# EAGLE design mLRS-tx-dual-base-v042-np (EAGLE 7.5.0)
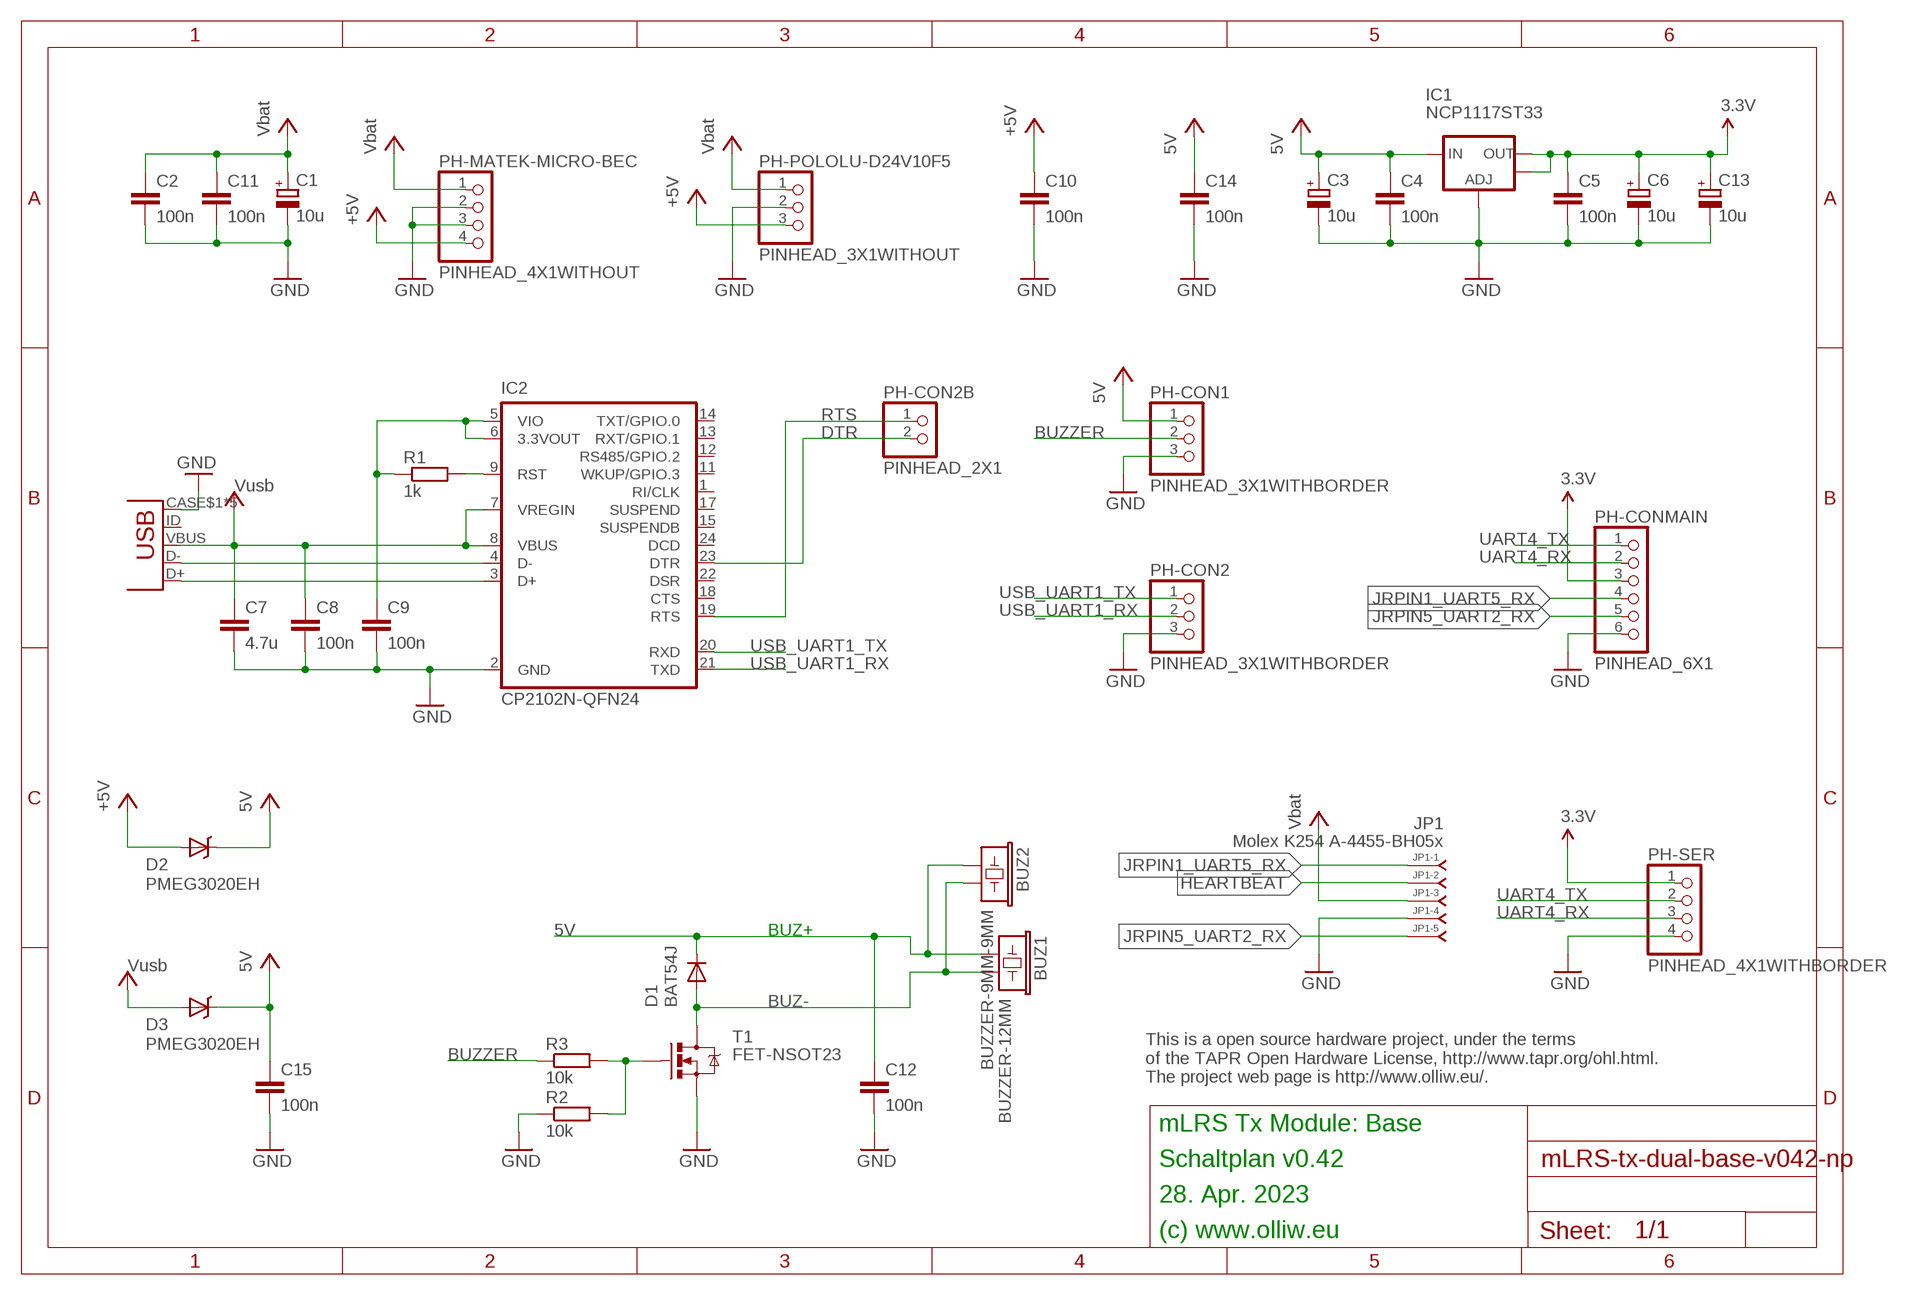
[diagram p0: schematic, sheet 1]

## Parts
BUZ1  BUZZER-12MM  [BUZZER-12MM]
BUZ2  BUZZER-9MM-9MM  [BUZZER-9MM]
C1  10u  CPOL-EUSMCA  [SMC_A]
C2  100n  C-EUC0603  [C0603]
C3  10u  CPOL-EUSMCA  [SMC_A]
C4  100n  C-EUC0603  [C0603]
C5  100n  C-EUC0603  [C0603]
C6  10u  CPOL-EUSMCA  [SMC_A]
C7  4.7u  C-EUC0603  [C0603]
C8  100n  C-EUC0402  [C0402]
C9  100n  C-EUC0402  [C0402]
C10  100n  C-EUC0603  [C0603]
C11  100n  C-EUC0603  [C0603]
C12  100n  C-EUC0603  [C0603]
C13  10u  CPOL-EUSMCA  [SMC_A]
C14  100n  C-EUC0603  [C0603]
C15  100n  C-EUC0603  [C0603]
D1  BAT54J  DIODE-SOD110-R  [SOD110-R]
D2  PMEG3020EH  DIODE-SCHOTTKYSOD123-W  [SOD123W-DIODE]
D3  PMEG3020EH  DIODE-SCHOTTKYSOD123-W  [SOD123W-DIODE]
IC1  NCP1117ST33  V_REG_LM1117SOT223  [SOT223]
IC2  CP2102N-QFN24  [QFN24-CP2102N]
JP1  Molex K254 A-4455-BH05x  4455-B05_S  [4455-B05]
PH-CON1  PINHEAD_3X1WITHBORDER  [PINHEAD_3X1]
PH-CON2  PINHEAD_3X1WITHBORDER  [PINHEAD_3X1]
PH-CON2B  PINHEAD_2X1  [PINHEAD_2X1]
PH-CONMAIN  PINHEAD_6X1  [PINHEAD_6X1]
PH-MATEK-MICRO-BEC  PINHEAD_4X1WITHOUT  [PINHEAD_4X1_WO]
PH-POLOLU-D24V10F5  PINHEAD_3X1WITHOUT  [PINHEAD_3X1_WO]
PH-SER  PINHEAD_4X1WITHBORDER  [PINHEAD_4X1]
R1  1k  R-EU_R0402  [R0402]
R2  10k  R-EU_R0402  [R0402]
R3  10k  R-EU_R0402  [R0402]
T1  FET-NSOT23  [SOT23]
USB1  USB-MICROB-UP-NONPLATED  [USB-MICROB-UP-NONPLATED]

## Nets
3.3V: C5.1 C6.+ C13.+ IC1.2(OUT) IC1.4(OUT) PH-CONMAIN.3 PH-SER.1
3.3V-CP2102: C9.1 IC2.5(VIO) IC2.6(3.3VOUT) R1.1
5V: BUZ1.+ BUZ2.+ C3.+ C4.1 C12.1 C14.1 C15.1 D1.C D2.C D3.C IC1.3(IN) PH-CON1.1
+5V: C10.1 D2.A PH-MATEK-MICRO-BEC.4 PH-POLOLU-D24V10F5.3
BUZ-: BUZ1.- BUZ2.- D1.A T1.3(D)
BUZZER: PH-CON1.2 R3.1
DTR: IC2.23(DTR) PH-CON2B.2
GND: C1.- C2.2 C3.- C4.2 C5.2 C6.- C7.2 C8.2 C9.2 C10.2 C11.2 C12.2 C13.- C14.2 C15.2 IC1.1(ADJ) IC2.2(GND) JP1.4 PH-CON1.3 PH-CON2.3 PH-CONMAIN.6 PH-MATEK-MICRO-BEC.2 PH-MATEK-MICRO-BEC.3 PH-POLOLU-D24V10F5.2 PH-SER.4 R2.1 T1.2(S) USB1.CASE$1(GND) USB1.CASE$2(GND) USB1.CASE$3(GND) USB1.CASE$4(GND) USB1.GND
HEARTBEAT: JP1.2
JRPIN1_UART5_RX: JP1.1 PH-CONMAIN.4
JRPIN5_UART2_RX: JP1.5 PH-CONMAIN.5
N$1: IC2.4(D-) USB1.D-
N$2: R2.2 R3.2 T1.1(G)
N$3: IC2.3(D+) USB1.D+
N$21: IC2.9(RST) R1.2
RTS: IC2.19(RTS) PH-CON2B.1
UART4_RX: PH-CONMAIN.2 PH-SER.3
UART4_TX: PH-CONMAIN.1 PH-SER.2
USB_UART1_RX: IC2.21(TXD) PH-CON2.2
USB_UART1_TX: IC2.20(RXD) PH-CON2.1
VBAT: C1.+ C2.1 C11.1 JP1.3 PH-MATEK-MICRO-BEC.1 PH-POLOLU-D24V10F5.1 ; supply symbol labelled Vbat
VUSB: C7.1 C8.1 D3.A IC2.7(VREGIN) IC2.8(VBUS) USB1.VBUS ; supply symbol labelled Vusb
Unconnected: IC2.1(RI/CLK) IC2.11(WKUP/GPIO.3) IC2.12(RS485/GPIO.2) IC2.13(RXT/GPIO.1) IC2.14(TXT/GPIO.0) IC2.15(SUSPENDB) IC2.17(SUSPEND) IC2.18(CTS) IC2.22(DSR) IC2.24(DCD) USB1.ID

## Notes on the sheet
- BUZ+
- This is a open source hardware project, under the terms
  of the TAPR Open Hardware License, http://www.tapr.org/ohl.html.
  The project web page is http://www.olliw.eu/.
- mLRS Tx Module: Base
- Schaltplan v0.42
- 28. Apr. 2023
- (c) www.olliw.eu

## Library data of the parts
BUZ1 BUZ2 = # stdlib:BUZZER
C1 C3 C6 C13 = rcl:CPOL-EU: POLARIZED CAPACITOR, European symbol
C2 C4 C5 C7-C12 C14 C15 = rcl:C-EU: CAPACITOR, European symbol
D1 = diode:DIODE-: DIODE
D2 D3 = # stdlib:DIODE-SCHOTTKY
IC1 = # SparkFun2:V_REG_LM1117: Voltage Regulator LM1117 Standard adjustable voltage regulator but in SMD form. Spark Fun Electronics SKU : COM-00595
IC2 = # stdlib:CP2102N-QFN24
JP1 = con-molex-kk:4455-B05_S: RECEPTACAL
PH-CON1 PH-CON2 PH-POLOLU-D24V10F5 = # stdlib:PINHEAD_3X1
PH-CON2B = # stdlib:PINHEAD_2X1
PH-CONMAIN = # stdlib:PINHEAD_6X1
PH-MATEK-MICRO-BEC PH-SER = # stdlib:PINHEAD_4X1
R1-R3 = rcl:R-EU_: RESISTOR, European symbol
T1 = # stdlib:FET-N
USB1 = # stdlib:USB-MICROB

## Board
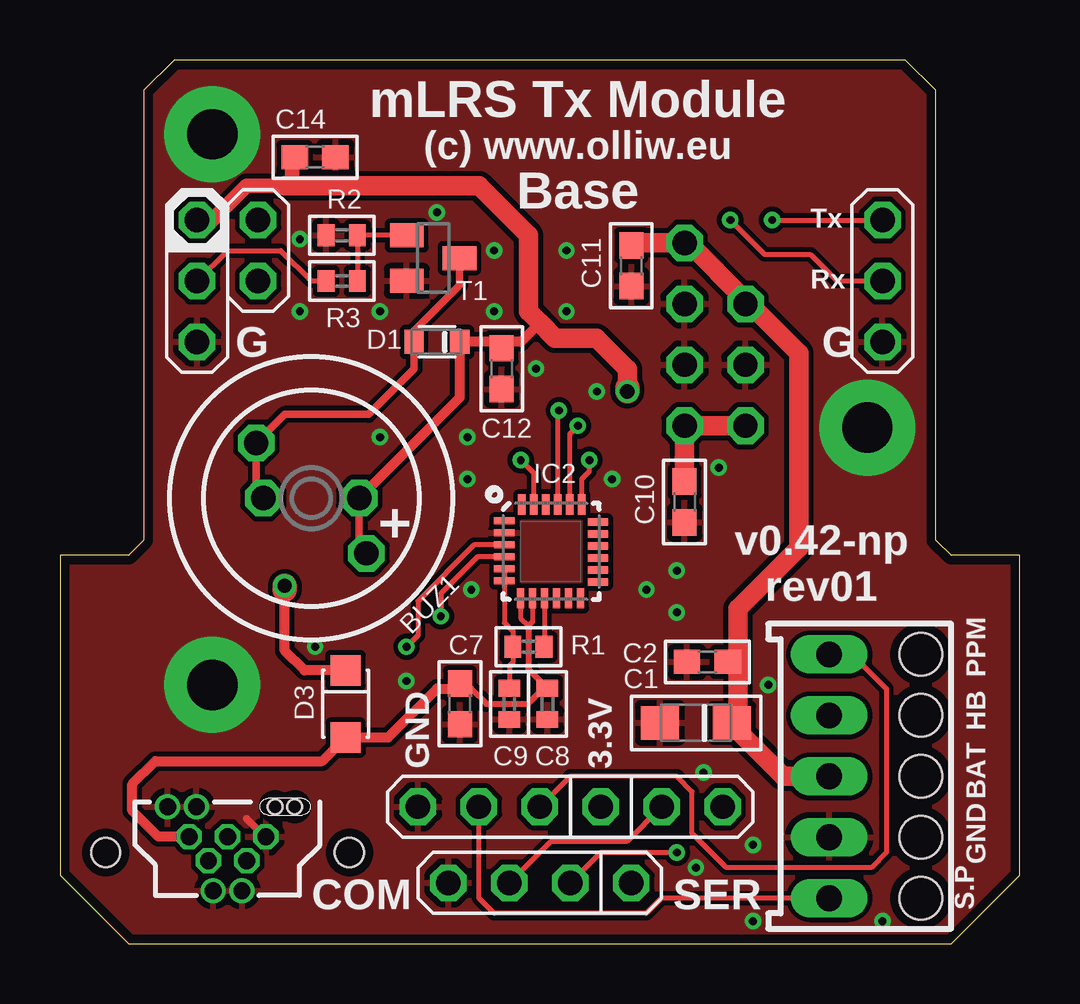
[diagram p1: board, top side]
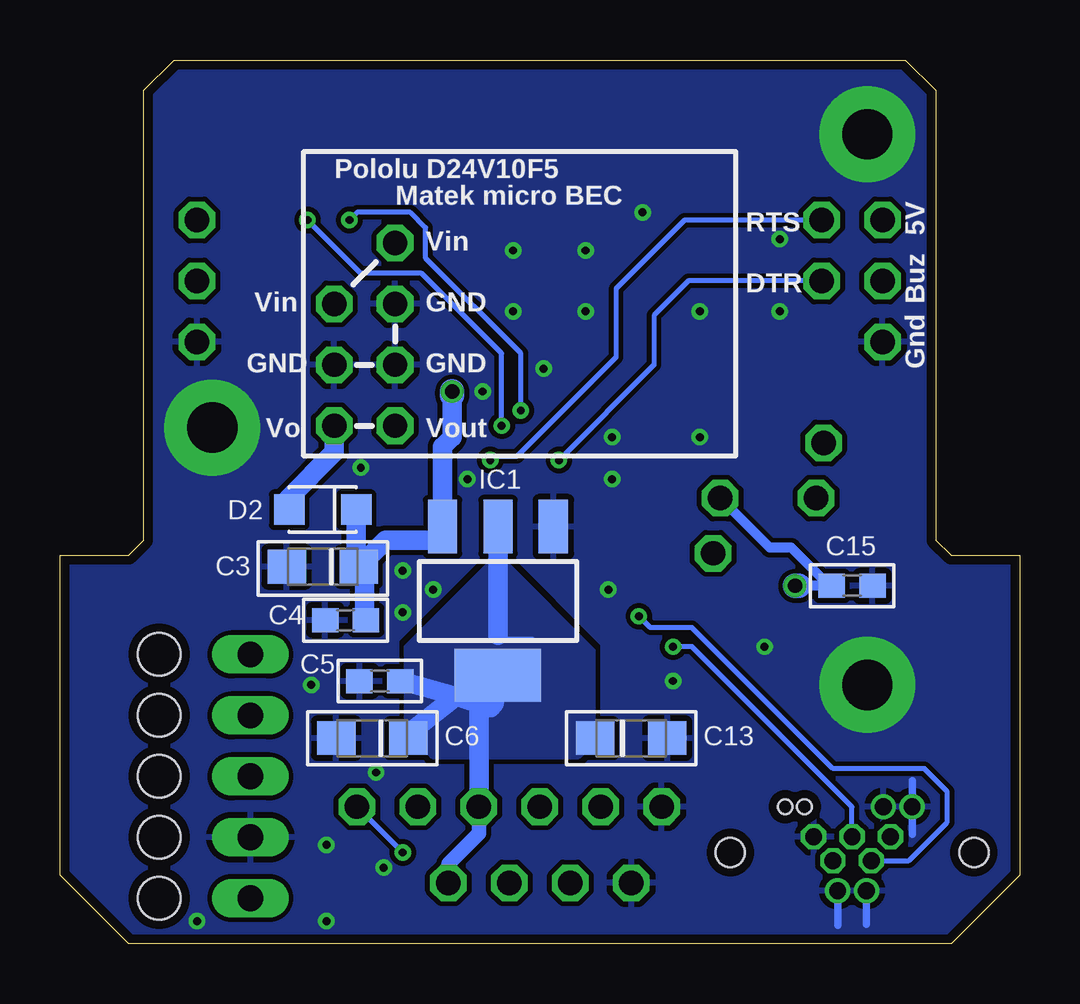
[diagram p2: board, bottom side, seen from below]

Size 40.01 x 36.83 mm. Coordinates in mm from the lower left corner, seen from the top.
Outline: 2.86,0 37.15,0 40.01,2.86 40.01,16.19 37.15,16.19 36.51,16.83 36.51,35.56 35.24,36.83 4.76,36.83 3.49,35.56 3.49,16.83 2.86,16.19 0,16.19 0,2.86 2.86,0
Copper layers (1*16): Top 0.0356mm / dielectric 1.5011mm / Bottom 0.0356mm
Design rules "ow-oshpark-2layer": minimum track width 6mil, minimum drill 13mil, track to track 6mil, track to pad 6mil, pad to pad 6mil, via to via 6mil, smd to smd 6mil, copper to edge 15mil, drill to drill 6mil, minimum pad ring 7mil, minimum via ring 7mil, stop-mask expansion 2.5mil, vias tented up to drill 26mil, thermal gap 10mil
Holes 0.6 mm at 8.97,5.71 9.78,5.71
Holes 1.2 mm at 1.91,3.81 12.06,3.81

### Footprints (pad centres in the part's own frame; a part is rotated, then mirrored left to right if it is on the bottom)
BUZZER-12MM = drill 1.016 octagon: + 3.25,0; - -3.25,0
BUZZER-9MM = drill 1.016 octagon: + 2,0; - -2,0
SMC_A = smd 1.6 x 1.4: + -1.5,0; - 1.5,0
C0603 = smd 1.1 x 1: 1 -0.85,0; 2 0.85,0
C0402 = smd 0.7 x 0.9: 1 -0.65,0; 2 0.65,0
SOD110-R = smd 0.8 x 1: A 0.95,0; C -0.95,0
SOD123W-DIODE = smd 1.27 x 1.27: A -1.4,0; C 1.4,0
SOT223 = smd 1.219 x 2.235: 1 -2.311,-3.099; 2 0,-3.099; 3 2.311,-3.099 | smd 3.6 x 2.2: 4 0,3.099
QFN24-CP2102N = smd 0.85 x 0.3: 1 -1.95,1.275; 2 -1.95,0.775; 3 -1.95,0.275; 4 -1.95,-0.225; 5 -1.95,-0.725; 6 -1.95,-1.225; 13 1.95,-1.275; 14 1.95,-0.775; 15 1.95,-0.275; 16 1.95,0.225; 17 1.95,0.725; 18 1.95,1.225 | smd 0.3 x 0.85: 7 -1.275,-1.95; 8 -0.775,-1.95; 9 -0.275,-1.95; 10 0.225,-1.95; 11 0.725,-1.95; 12 1.225,-1.95; 19 1.275,1.95; 20 0.775,1.95; 21 0.275,1.95; 22 -0.225,1.95; 23 -0.725,1.95; 24 -1.225,1.95
4455-B05 = drill 1.067 long: 1 -5.08,0; 2 -2.54,0; 3 0,0; 4 2.54,0; 5 5.08,0 | hole 1.778: -5.08,3.81; -2.54,3.81; 0,3.81; 2.54,3.81; 5.08,3.81
PINHEAD_3X1 = drill 1.016 octagon: 1 0,0; 2 0,-2.54; 3 0,-5.08
PINHEAD_2X1 = drill 1.016 octagon: 1 0,0; 2 0,-2.54
PINHEAD_6X1 = drill 1.016 octagon: 1 0,12.7; 2 0,10.16; 3 0,7.62; 4 0,5.08; 5 0,2.54; 6 0,0
PINHEAD_4X1_WO = drill 1.016 octagon: 1 0,0; 2 0,-2.54; 3 0,-5.08; 4 0,-7.62
PINHEAD_3X1_WO = drill 1.016 octagon: 1 0,0; 2 0,-2.54; 3 0,-5.08
PINHEAD_4X1 = drill 1.016 octagon: 1 0,7.62; 2 0,5.08; 3 0,2.54; 4 0,0
R0402 = smd 0.7 x 0.9: 1 -0.65,0; 2 0.65,0
SOT23 = smd 1 x 1.4: 1 -0.95,-1.1; 2 0.95,-1.1; 3 0,1.1
USB-MICROB-UP-NONPLATED = drill 0.7 pad 1: CASE$1 1.75,0.6; CASE$2 1.75,-0.6; CASE$3 -1.75,-1.3; CASE$4 -1.75,-2.5 | drill 0.7 pad 1 octagon: D+ -0.5,0; D- 0.5,-0.8; GND -0.5,1.6; ID 0.5,0.8; VBUS -0.5,-1.6

### Placement (x,y rotation side)
BUZ1  10.48,18.57 315 top
BUZ2  10.48,18.57 0 top
C1  26.51,9.21 180 top
C2  26.99,11.75 180 top
C3  29.05,15.72 180 bottom
C4  28.1,13.49 180 bottom
C5  26.67,10.95 180 bottom
C6  26.99,8.57 180 bottom
C7  16.67,10 270 top
C8  20.32,10 270 top
C9  18.73,10 270 top
C10  26.04,18.41 270 top
C11  23.81,28.26 270 top
C12  18.41,23.97 270 top
C13  16.19,8.57 0 bottom
C14  10.64,32.78 0 top
C15  6.99,14.92 0 bottom
D1  15.72,25.08 180 top
D2  29.05,18.1 0 bottom
D3  11.91,10 90 top
IC1  21.75,14.29 180 bottom
IC2  20.48,16.35 0 top
JP1  32.07,6.99 270 top
PH-CON1  5.71,30.16 0 top
PH-CON2  34.29,30.16 0 top
PH-CON2B  8.26,30.16 0 top
PH-CONMAIN  14.92,5.71 270 top
PH-MATEK-MICRO-BEC  26.04,29.21 0 top
PH-POLOLU-D24V10F5  28.57,26.67 0 top
PH-SER  16.19,2.54 270 top
R1  19.53,12.38 0 top
R2  11.75,29.53 0 top
R3  11.75,27.62 0 top
T1  15.56,28.57 270 top
USB1  6.99,3.97 270 top

### Tracks (layer width: path | path; a pad name or v marks a point on that pad's centre or on a via)
3.3V
  Bottom 0.203: 20.32,12.7 21.75,12.7 21.75,12.86
  Bottom 0.61: PH-CONMAIN.3 22.54,4.6 23.81,3.33 PH-SER.1
  Bottom 0.813: 21.75,12.86 IC1.2 | C6.+ 25.72,8.57 23.49,10.32 | 23.49,10.32 25.72,10.95 C5.1 | 23.49,10.32 22.07,9.84 21.91,10 IC1.4 22.54,10.55 PH-CONMAIN.3
  pour Bottom (no thermals): 18.41,7.78 24.45,7.78 25.56,9.05 25.56,12.38 22.07,15.88 21.43,15.88 17.78,12.22 17.78,8.41
3.3V-CP2102
  Top 0.203: IC2.5 IC2.6 18.53,13.38 18.89,13.02 18.89,12.4 R1.1 18.88,11.73 18.73,11.59 C9.1
5V  (via drill 0.6)
  Top 0.305: BUZ2.+ 12.48,16.41 BUZ1.+
  Top 0.406: 20,25.88 19.21,25.08 18.56,25.08 18.56,24.96 C12.1 18.41,25.08 D1.C 16.67,22.76 BUZ2.+ | 9.37,14.76 9.37,12.22 10.19,11.4 D3.C
  Top 0.61: PH-CON1.1 6.35,30.16 7.78,31.59 9.37,31.59 | C14.1 9.68,32.78 9.68,31.59
  Top 0.813: 9.37,31.59 9.68,31.59 17.46,31.59 19.53,29.53 19.53,26.35 20,25.88 20.64,25.24 22.35,25.24 23.65,23.94 23.65,23.18
  Top 1.016: v23.65,23.02 23.65,23.18 | v9.37,14.92 9.37,14.76
  Bottom 0.406: 9.21,14.92 C15.1 7.94,14.92 9.53,16.51 10.41,16.51 BUZ2.+
  Bottom 0.813: D2.C 27.65,15.82 C3.+ | C3.+ 26.44,16.83 24.29,16.83 24.22,16.9 IC1.3 24.06,20.71 23.65,21.11 23.65,22.86 | C3.+ 27.46,15.72 27.3,15.56 27.3,13.55 C4.1
  Bottom 1.016: 23.65,22.86 v23.65,23.02 | v9.37,14.92 9.21,14.92
+5V
  Top 0.813: C10.1 PH-MATEK-MICRO-BEC.4 PH-POLOLU-D24V10F5.3
  Bottom 0.813: PH-POLOLU-D24V10F5.3 28.57,20.48 30.48,18.57 30.48,18.13 D2.A
BUZ-
  Top 0.305: T1.3 16.66,27.45 14.76,25.56 14.76,24.93 | 14.76,24.93 D1.A | 14.76,24.93 14.76,23.97 12.86,22.07 9.37,22.07 BUZ1.- 8.18,18.87 BUZ2.-
BUZZER
  Top 0.203: PH-CON1.2 6.99,28.89 9.21,28.89 10.48,27.62 R3.1
DTR  (via drill 0.33)
  Top 0.203: IC2.23 19.75,19.62 v19.21,20.16
  Bottom 0.203: PH-CON2B.2 13.81,27.62 15.24,26.19 15.24,24.13 v19.21,20.16
GND  (via drill 0.33, 2.1 pad 4)
  Top 0.305: 7.78,5.22 8.57,4.42
  Bottom 0.305: 4.48,6.8 4.48,4.58 | 6.38,2.25 6.38,0.82 | 7.57,2.21 7.57,0.77
  other vias: 33.66,21.51 6.35,33.73 26.51,3.17 6.35,10.79 34.29,0.95 28.89,0.95 29.53,10.79 28.89,4.13 23.02,19.37 22.38,23.02 16.99,19.37 16.99,21.11 27.46,19.84 18.1,26.35 21.11,26.35 21.11,28.89 13.34,26.35 14.45,10.95 26.83,7.14 25.72,13.81 25.72,15.56 24.45,14.76 13.34,21.11 17.14,14.76 19.84,23.97 10,29.37 10,26.35 15.72,30.48 18.1,28.89 10.64,12.38
  pour Bottom (isolate 0.203, rank 6): -0.64,37.15 40.64,37.15 40.64,-0.64 -0.64,-0.64
  pour Top (isolate 0.203, rank 6): -0.64,37.15 40.64,37.15 40.64,-0.64 -0.64,-0.64
JRPIN1_UART5_RX
  Top 0.203: JP1.1 33.02,12.06 34.45,10.64 34.45,3.81 33.81,3.17 27.78,3.17 26.35,4.6 26.35,6.35 25.72,6.99 21.27,6.99 PH-CONMAIN.4
JRPIN5_UART2_RX
  Top 0.203: JP1.5 25.08,1.91 24.45,1.27 18.1,1.27 17.46,1.91 PH-CONMAIN.5
N$1  (via drill 0.33)
  Top 0.203: IC2.4 17.4,16.13 15.88,14.61 v15.88,13.65
  Bottom 0.203: v15.88,13.65 15.4,13.18 13.65,13.18 7.78,7.3 3.97,7.3 3.02,6.35 3.02,5.08 4.63,3.47 USB1.D-
N$2
  Top 0.203: T1.1 R2.2 | R2.2 R3.2 | R2.2
N$3  (via drill 0.33)
  Top 0.203: IC2.3 17.26,16.63 14.92,14.29 14.92,12.86 v14.45,12.38
  Bottom 0.203: v14.45,12.38 13.65,12.38 6.99,5.71 USB1.D+
N$21
  Top 0.203: 20.09,12.61 20.16,12.54 20.16,12.4 R1.2 20.2,12.41 IC2.9
RTS  (via drill 0.33)
  Top 0.203: IC2.19 21.75,19.37 22.07,19.68 v22.07,20.16
  Bottom 0.203: v22.07,20.16 21.91,20.32 20.95,20.32 16.83,24.45 16.83,27.3 13.97,30.16 PH-CON2B.1
UART4_RX
  Top 0.203: PH-SER.3 20.48,4.29 23.65,4.29 PH-CONMAIN.2
UART4_TX  (via drill 0.33)
  Top 0.203: PH-SER.2 22.54,3.81 v25.72,3.81
  Bottom 0.203: v25.72,3.81 PH-CONMAIN.1
USB_UART1_RX  (via drill 0.33)
  Top 0.203: IC2.21 20.75,22.18 v20.8,22.23 | v27.94,30.16 29.37,28.73 31.27,28.73 32.39,27.62 PH-CON2.2
  Bottom 0.203: v27.94,30.16 27.62,30.48 25.4,30.48 24.76,29.84 24.76,28.57 20.8,24.61 v20.8,22.23
USB_UART1_TX  (via drill 0.33)
  Top 0.203: IC2.20 21.25,21.25 v21.59,21.59 | v29.69,30.16 PH-CON2.1
  Bottom 0.203: v21.59,21.59 21.59,24.61 24.92,27.94 27.46,27.94 v29.69,30.16
VBAT
  Top 0.203: 28.26,8.89 28.26,8.8
  Top 0.406: C1.+ 28.26,9.21 | C2.1 28.26,11.75 | 23.87,29.21 23.87,29.16 C11.1 | 28.73,26.67 PH-POLOLU-D24V10F5.1 28.57,26.83
  Top 0.813: 23.87,29.21 PH-MATEK-MICRO-BEC.1 26.19,29.21 28.57,26.83 | JP1.3 30.16,6.99 28.26,8.89 28.26,9.21 28.26,11.75 28.26,13.97 30.8,16.51 30.8,24.61 28.73,26.67
VUSB
  Top 0.203: C8.1 20.16,10.65 | IC2.8 19.7,13.43 19.53,13.26 19.2,13.58 IC2.7
  Top 0.254: 19.53,13.26 19.53,11.45 C8.1 | 20.16,10.65 19.51,10 17.78,10 17.14,10.64 16.51,10.64 C7.1
  Top 0.406: USB1.VBUS 4.1,4.47 3.02,5.56 3.02,6.67 3.97,7.62 10.93,7.62 D3.A 13.68,8.6 15.72,10.64 16.45,10.64 C7.1

### Text on the board
tNames: mLRS Tx Module | (c) www.olliw.eu | Base | Tx | Rx | G | G | + | v0.42-np / rev01 | PPM | HB | GND | 3.3V | BAT | GND | COM | SER | S.P
bNames: Pololu D24V10F5 | Matek micro BEC | 5V | RTS | Vin | Buz | DTR | GND | Vin | Gnd | GND | GND | Vout | Vo